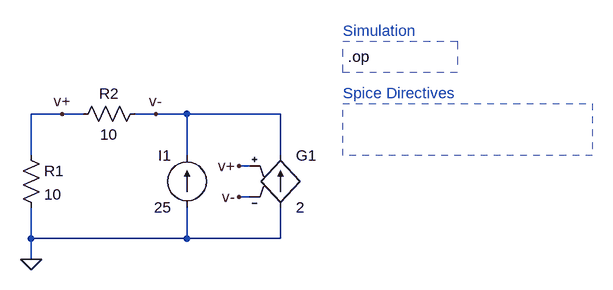
[diagram p0: schematic VCCS_g.asc]
VCCS_g.asc, the LTspice schematic file:
Version 4
SHEET 1 1432 696
WIRE 208 176 160 176
WIRE 240 176 208 176
WIRE 352 176 320 176
WIRE 400 176 352 176
WIRE 544 176 400 176
WIRE 160 240 160 176
WIRE 400 240 400 176
WIRE 544 240 544 176
WIRE 496 256 480 256
WIRE 496 304 480 304
WIRE 160 368 160 320
WIRE 400 368 400 320
WIRE 400 368 160 368
WIRE 544 368 544 320
WIRE 544 368 400 368
WIRE 160 400 160 368
FLAG 480 256 v+
FLAG 480 304 v-
FLAG 208 176 v+
FLAG 352 176 v-
FLAG 160 400 0
SYMBOL g 544 224 R0
SYMATTR InstName G1
SYMATTR Value 2
SYMBOL res 144 224 R0
SYMATTR InstName R1
SYMATTR Value 10
SYMBOL res 336 160 R90
WINDOW 0 0 56 VBottom 2
WINDOW 3 32 56 VTop 2
SYMATTR InstName R2
SYMATTR Value 10
SYMBOL current 400 320 R180
WINDOW 0 24 80 Left 2
WINDOW 3 24 0 Left 2
SYMATTR InstName I1
SYMATTR Value 25
TEXT 640 48 Left 2 ;Simulation
TEXT 648 88 Left 2 !.op
TEXT 640 144 Left 2 ;Spice Directives
RECTANGLE Normal 816 112 640 64 2
RECTANGLE Normal 1024 240 640 160 2

The netlist it stands for:
* VCCS_g.asc
G1 0 v- v+ v- 2
R1 v+ 0 10
R2 v- v+ 10
I1 0 v- 25
* Simulation
.op
* Spice Directives
.backanno
.end